# EAGLE design ax12board (EAGLE 5.06)
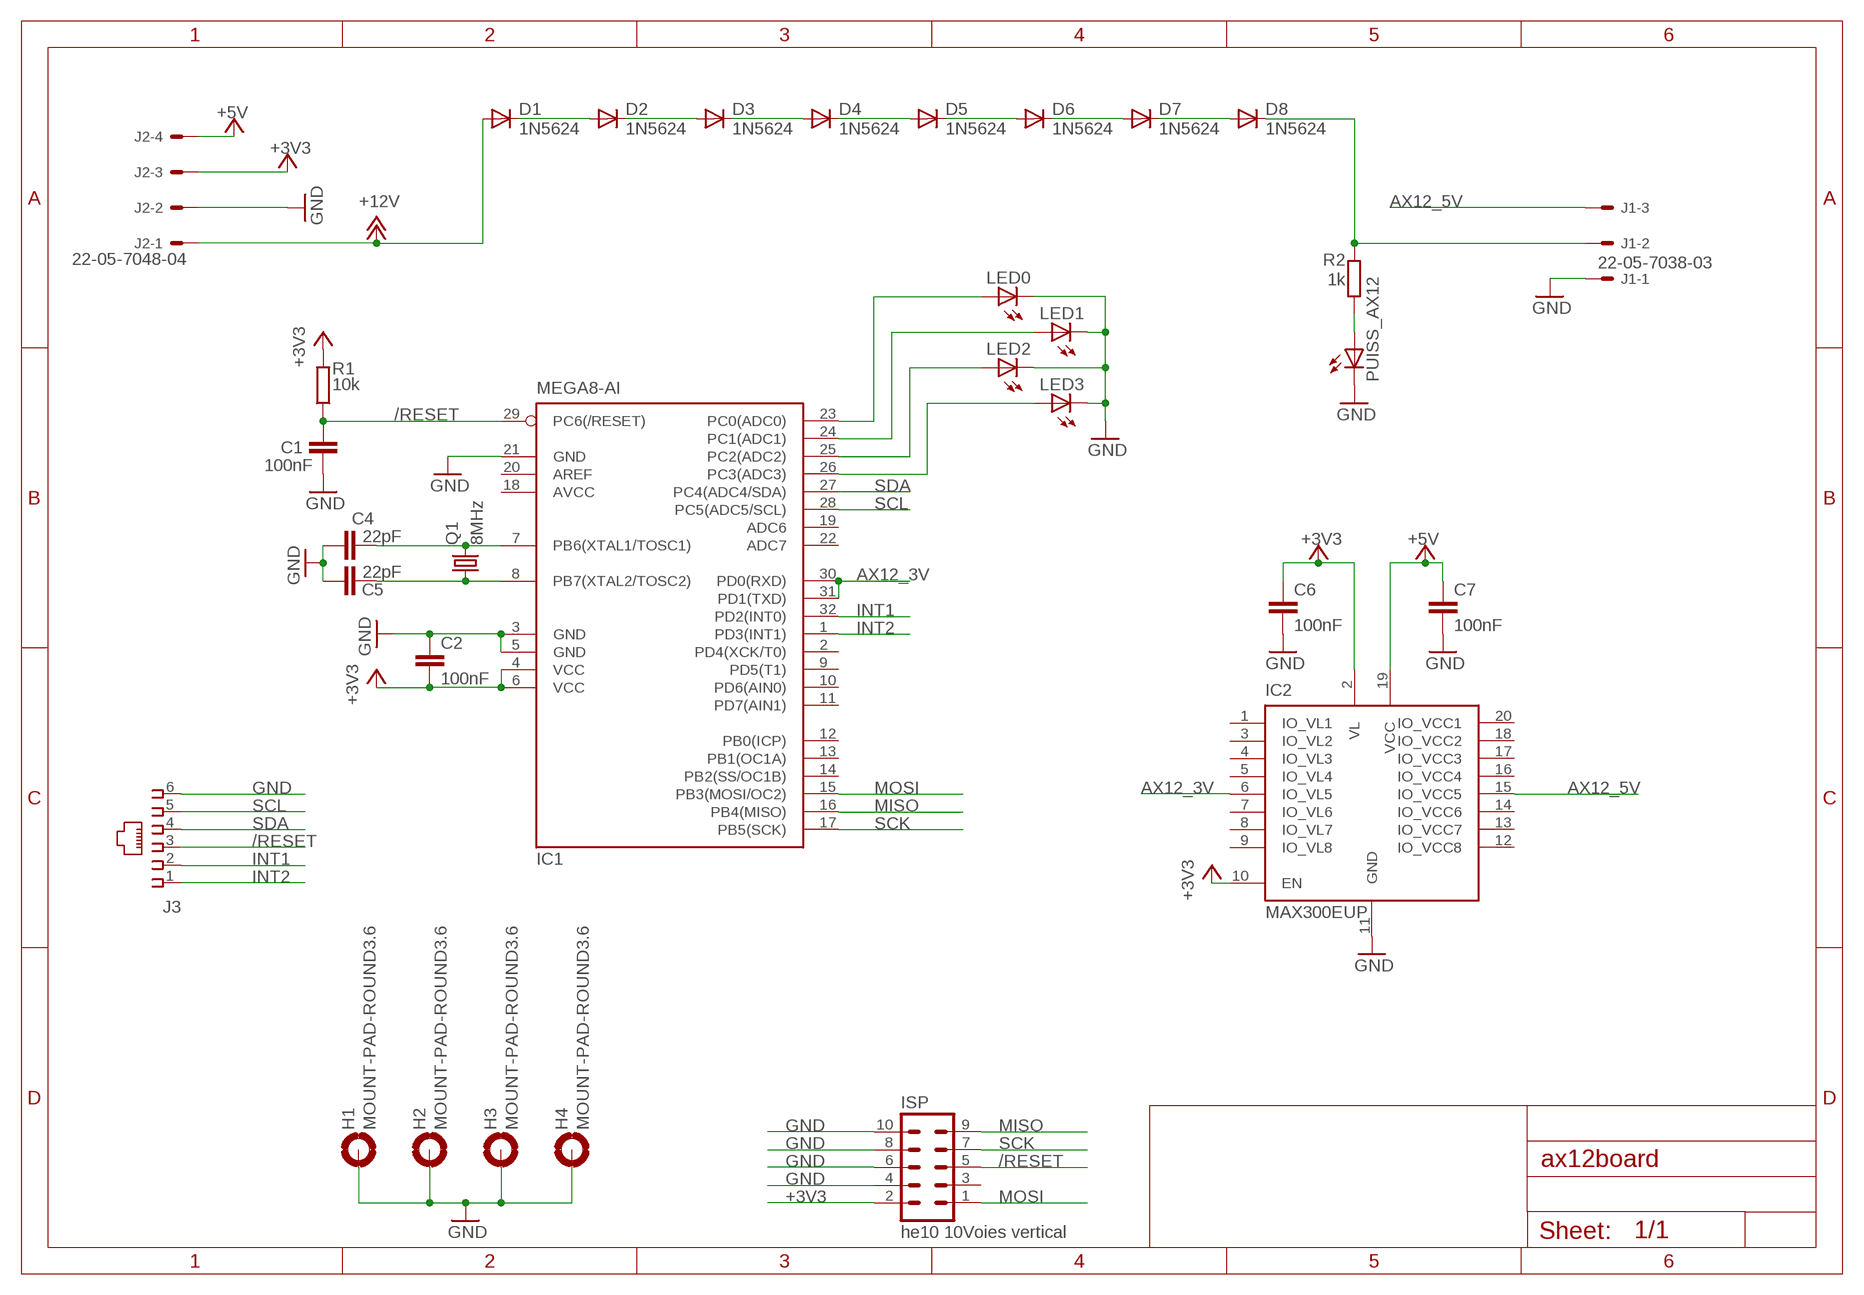
[diagram p0: schematic, sheet 1]

## Parts
C1  100nF  C-EU025-025X050  [C025-025X050]
C2  100nF  C-EU025-025X050  [C025-025X050]
C4  22pF  C-EUC0805  [C0805]
C5  22pF  C-EUC0805  [C0805]
C6  100nF  C-EU025-030X050  [C025-030X050]
C7  100nF  C-EU025-030X050  [C025-030X050]
D1  1N5624  [DO201-15]
D2  1N5624  [DO201-15]
D3  1N5624  [DO201-15]
D4  1N5624  [DO201-15]
D5  1N5624  [DO201-15]
D6  1N5624  [DO201-15]
D7  1N5624  [DO201-15]
D8  1N5624  [DO201-15]
H1  MOUNT-PAD-ROUND3.6  [3,6-PAD]
H2  MOUNT-PAD-ROUND3.6  [3,6-PAD]
H3  MOUNT-PAD-ROUND3.6  [3,6-PAD]
H4  MOUNT-PAD-ROUND3.6  [3,6-PAD]
IC1  MEGA8-AI  [TQFP32-08]
IC2  MAX300EUP  [TSSOP20]
ISP  he10 10Voies vertical  ML10L  [ML10L]
J1  22-05-7038-03  [7395-03]
J2  22-05-7048-04  [7395-04]
J3  520258-3  [520258-3]
LED0  LEDCHIPLED_1206  [CHIPLED_1206]
LED1  LEDCHIPLED_1206  [CHIPLED_1206]
LED2  LEDCHIPLED_1206  [CHIPLED_1206]
LED3  LEDCHIPLED_1206  [CHIPLED_1206]
PUISS_AX12  LEDCHIPLED_1206  [CHIPLED_1206]
Q1  8MHz  CRYSTALHC49S  [HC49/S]
R1  10k  R-EU_0207/10  [0207/10]
R2  1k  R-EU_R0805  [R0805]

## Nets
+3V3: C2.2 C6.1 IC1.4(VCC) IC1.6(VCC) IC2.2(VL) IC2.10(EN) ISP.2 J2.3 R1.2
+5V: C7.1 IC2.19(VCC) J2.4
+12V: D1.A J2.1
/RESET: C1.1 IC1.29(PC6(/RESET)) ISP.5 J3.3 R1.1
AX12_3V: IC1.30(PD0(RXD)) IC1.31(PD1(TXD)) IC2.6(IO_VL5)
AX12_5V: IC2.15(IO_VCC5) J1.3
GND: C1.2 C2.1 C4.1 C5.1 C6.2 C7.2 H1.B3,6(MOUNT) H2.B3,6(MOUNT) H3.B3,6(MOUNT) H4.B3,6(MOUNT) IC1.3(GND) IC1.5(GND) IC1.21(GND) IC2.11(GND) ISP.4 ISP.6 ISP.8 ISP.10 J1.1 J2.2 J3.6 LED0.C LED1.C LED2.C LED3.C PUISS_AX12.C
INT1: IC1.32(PD2(INT0)) J3.2
INT2: IC1.1(PD3(INT1)) J3.1
MISO: IC1.16(PB4(MISO)) ISP.9
MOSI: IC1.15(PB3(MOSI/OC2)) ISP.1
N$1: C4.2 IC1.7(PB6(XTAL1/TOSC1)) Q1.2
N$2: C5.2 IC1.8(PB7(XTAL2/TOSC2)) Q1.1
N$5: D1.C D2.A
N$6: D2.C D3.A
N$7: D3.C D4.A
N$9: D4.C D5.A
N$10: D5.C D6.A
N$11: D6.C D7.A
N$12: D7.C D8.A
N$13: D8.C J1.2 R2.2
N$14: PUISS_AX12.A R2.1
N$18: IC1.26(PC3(ADC3)) LED3.A
N$19: IC1.25(PC2(ADC2)) LED2.A
N$20: IC1.24(PC1(ADC1)) LED1.A
N$21: IC1.23(PC0(ADC0)) LED0.A
SCK: IC1.17(PB5(SCK)) ISP.7
SCL: IC1.28(PC5(ADC5/SCL)) J3.5
SDA: IC1.27(PC4(ADC4/SDA)) J3.4
Unconnected: IC1.2(PD4(XCK/T0)) IC1.9(PD5(T1)) IC1.10(PD6(AIN0)) IC1.11(PD7(AIN1)) IC1.12(PB0(ICP)) IC1.13(PB1(OC1A)) IC1.14(PB2(SS/OC1B)) IC1.19(ADC6) IC1.20(AREF) IC1.22(ADC7) IC2.1(IO_VL1) IC2.3(IO_VL2) IC2.4(IO_VL3) IC2.5(IO_VL4) IC2.7(IO_VL6) IC2.8(IO_VL7) IC2.9(IO_VL8) IC2.12(IO_VCC8) IC2.13(IO_VCC7) IC2.14(IO_VCC6) IC2.16(IO_VCC4) IC2.17(IO_VCC3) IC2.18(IO_VCC2) IC2.20(IO_VCC1) ISP.3

## Power pins joined to a net without a drawn wire
AVCC: IC1.18(AVCC)

## Library data of the parts
C1 C2 C4-C7 = rcl:C-EU: CAPACITOR, European symbol
D1-D8 = diode:1N5624: DIODE controlled avalanche rectifier
H1-H4 = holes:MOUNT-PAD-ROUND: MOUNTING PAD, round
IC1 = atmel:MEGA8: MICROCONTROLLER 8 Kbytes FLASH, 1 kbytes SRAM, 512 bytes EEPROM, USART, 6-channel 10 bit ADC, 2-channel 8 bit ADC Pin compatible with Atmega48, ATMega88, ATMega168 Source: avr.lbr
IC2 = robotter:MAX300*: max3000 to max3003 bidirectionnal level shifter
ISP = con-harting-ml:ML10: HARTING
J1 = con-molex:22-?-03: CONNECTOR wire to board 2.54 mm (.1 inch) pitch header
J2 = con-molex:22-?-04: CONNECTOR wire to board 2.54 mm (.1 inch) pitch header
J3 = con-amp:520258-3: AMP connector
LED0 LED1-LED3 PUISS_AX12 = led:LED: LED OSRAM: - CHIPLED LG R971, LG N971, LY N971, LG Q971, LY Q971, LO R971, LY R971 LH N974, LH R974 LS Q976, LO Q976, LY Q976 LO Q996 - Hyper CHIPLED LW Q18S LB Q993, LB Q99A, LB R99A - SideLED LS A670, LO A670, LY A670, LG A670, LP A670 LB A673, LV A673, LT A673, LW A673 LH A674 LY A675 LS A676, LA A676, LO A676, LY A676, LW A676 LS A679, LY A679, LG A679 - Hyper Micro SIDELED® LS Y876, LA Y876, LO Y876, LY Y876 LT Y87S - SmartLED LW L88C, LW L88S LB L89C, LB L89S, LG L890 LS L89K, LO L89K, LY L89K LS L896, LA L896, LO L896, LY L896 - TOPLED LS T670, LO T670, LY T670, LG T670, LP T670 LSG T670, LSP T670, LSY T670, LOP T670, LYG T670 LG T671, LOG T671, LSG T671 LB T673, LV T673, LT T673, LW T673 LH T674 LS T676, LA T676, LO T676, LY T676, LB T676, LH T676, LSB T676, LW T676 LB T67C, LV T67C, LT T67C, LS T67K, LO T67K, LY T67K, LW E67C LS E67B, LA E67B, LO E67B, LY E67B, LB E67C, LV E67C, LT E67C LW T67C LS T679, LY T679, LG T679 LS T770, LO T770, LY T770, LG T770, LP T770 LB T773, LV T773, LT T773, LW T773 LH T774 LS E675, LA E675, LY E675, LS T675 LS T776, LA T776, LO T776, LY T776, LB T776 LHGB T686 LT T68C, LB T68C - Hyper Mini TOPLED® LB M676 - Mini TOPLED Santana® LG M470 LS M47K, LO M47K, LY M47K Source: http://www.osram.convergy.de LUXEON: - LUMILED® LXK2-PW12-R00, LXK2-PW12-S00, LXK2-PW14-U00, LXK2-PW14-V00 LXK2-PM12-R00, LXK2-PM12-S00, LXK2-PM14-U00 LXK2-PE12-Q00, LXK2-PE12-R00, LXK2-PE12-S00, LXK2-PE14-T00, LXK2-PE14-U00 LXK2-PB12-K00, LXK2-PB12-L00, LXK2-PB12-M00, LXK2-PB14-N00, LXK2-PB14-P00, LXK2-PB14-Q00 LXK2-PR12-L00, LXK2-PR12-M00, LXK2-PR14-Q00, LXK2-PR14-R00 LXK2-PD12-Q00, LXK2-PD12-R00, LXK2-PD12-S00 LXK2-PH12-R00, LXK2-PH12-S00 LXK2-PL12-P00, LXK2-PL12-Q00, LXK2-PL12-R00 Source: www.luxeon.com KINGBRIGHT: KA-3528ASYC Source: www.kingbright.com
Q1 = crystal:CRYSTAL: CRYSTAL
R1 R2 = rcl:R-EU_: RESISTOR, European symbol

## Board
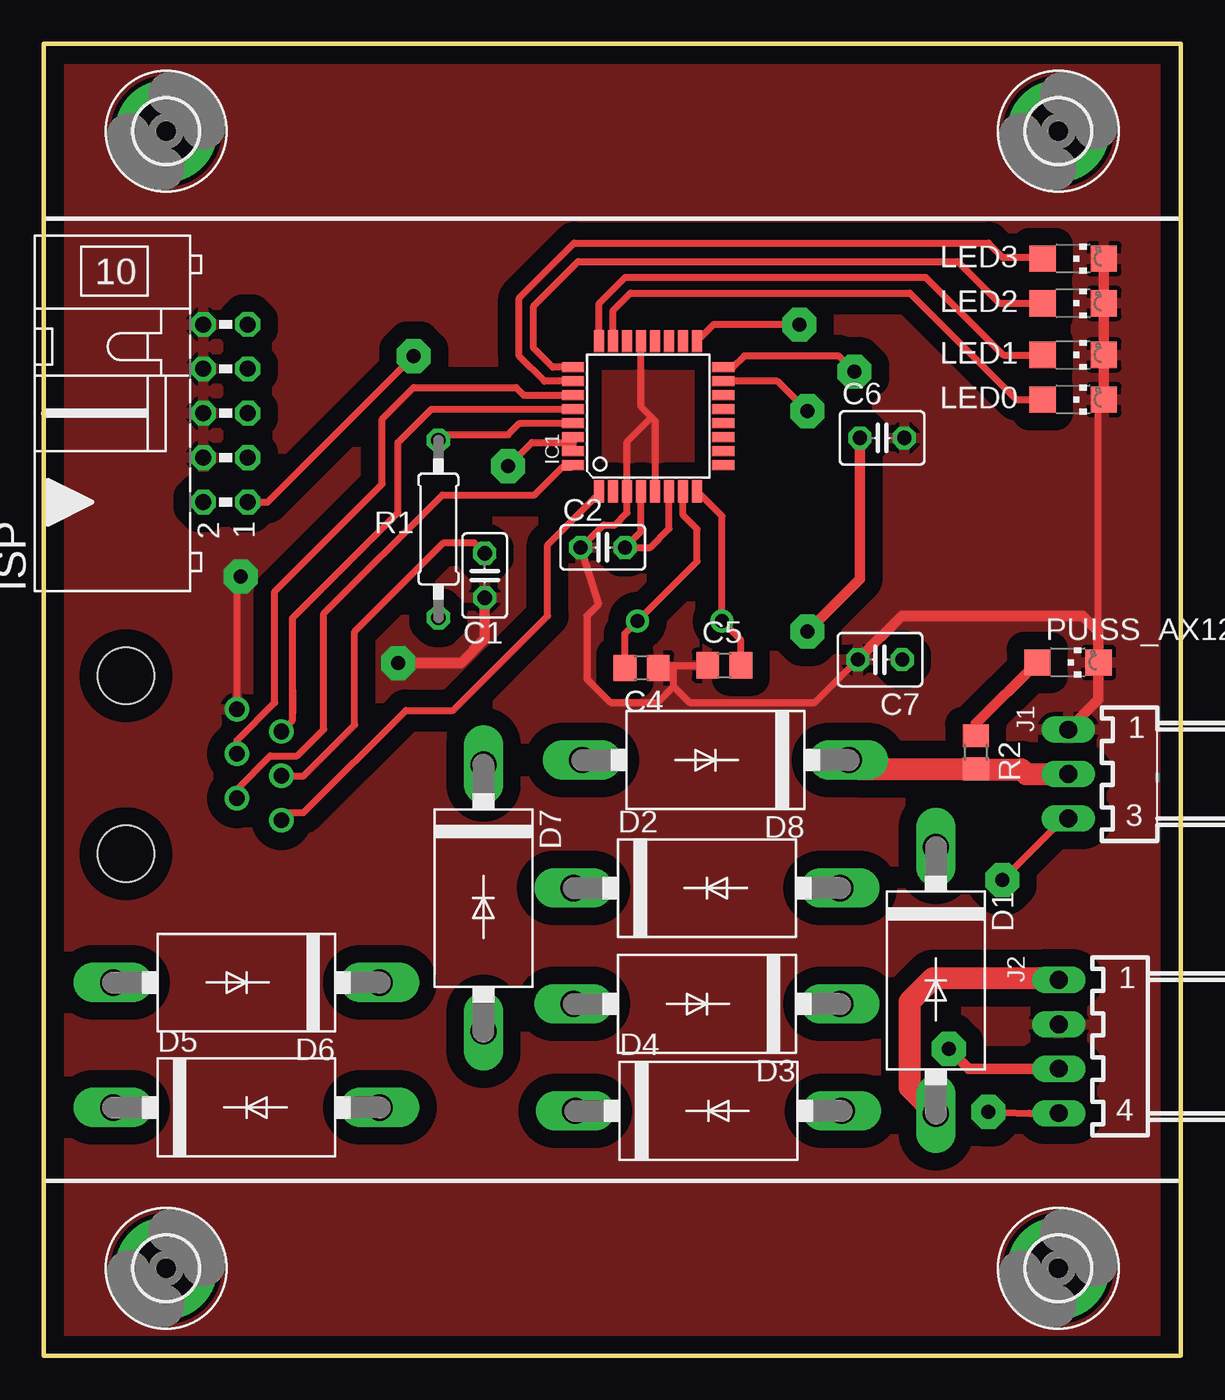
[diagram p1: board, top side]
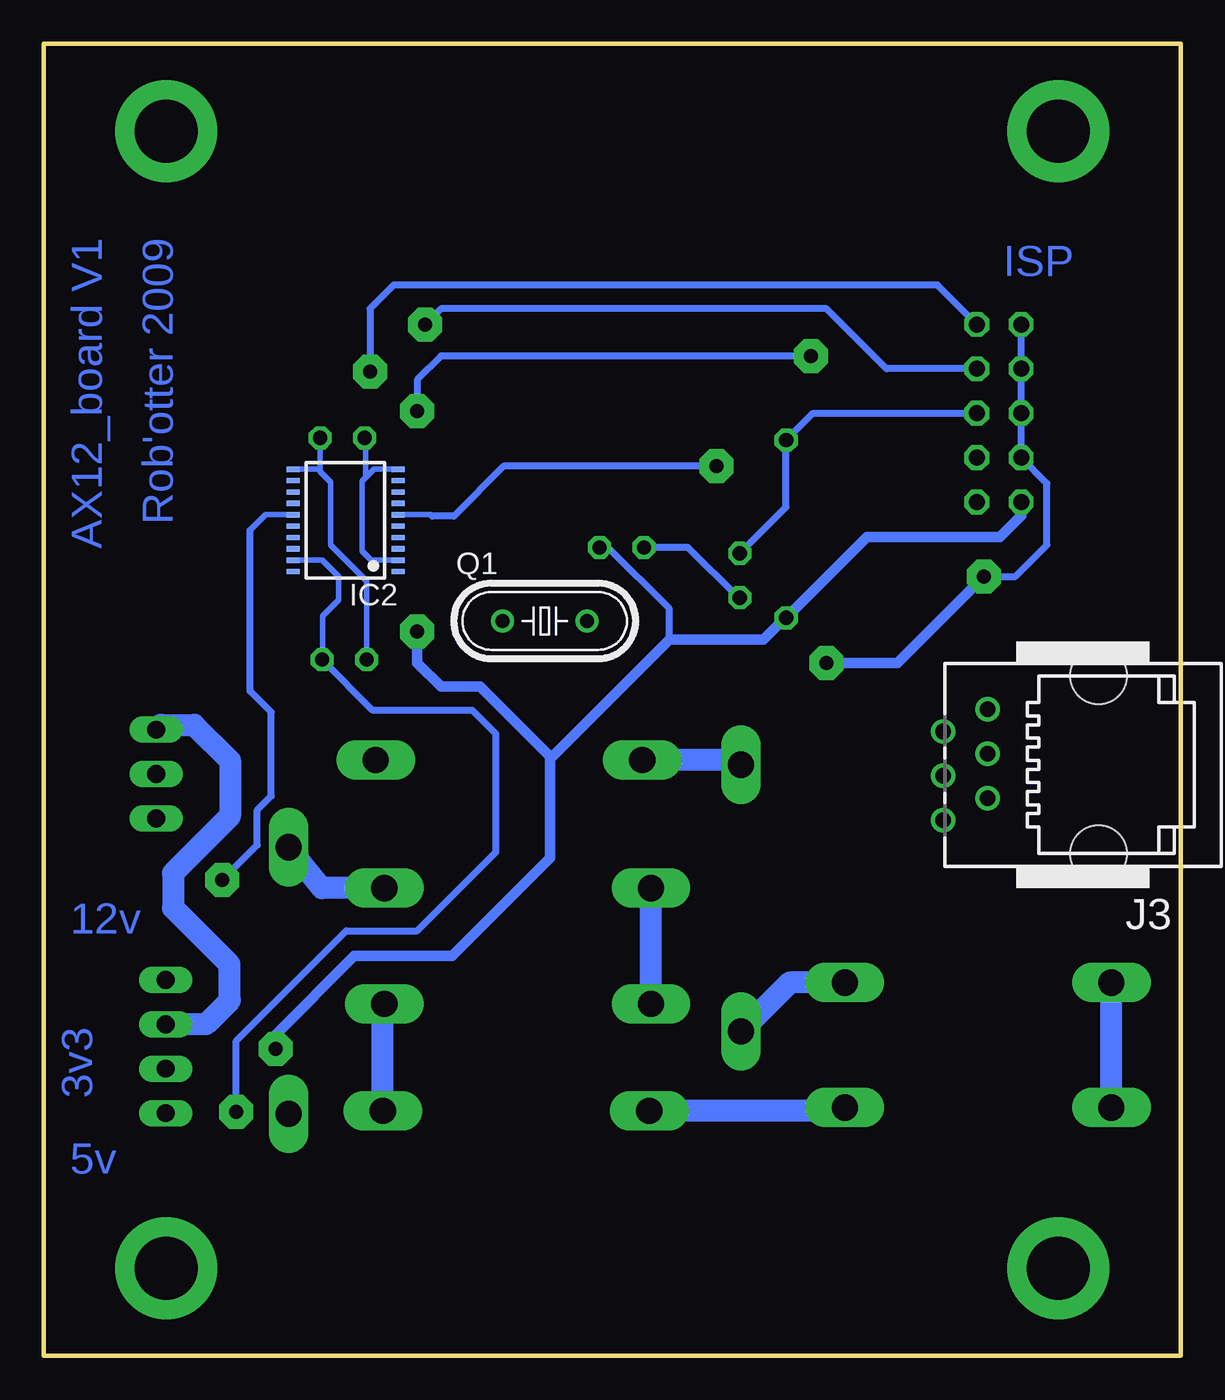
[diagram p2: board, bottom side, seen from below]

Size 65 x 75 mm. Coordinates in mm from the lower left corner, seen from the top.
Outline: 0,0 60,0
Outline: 0,55 0,10
Outline: 0,10 0,75 65,75 65,0 0,0
Outline: 0,10 0,0
Copper layers (1*16): Top 0.035mm / dielectric 1.5mm / Bottom 0.035mm
Design rules "default *": minimum track width 10mil, minimum drill 24mil, track to track 1mm, track to pad 1mm, pad to pad 8mil, via to via 8mil, smd to smd 8mil, copper to edge 40mil, drill to drill 8mil, minimum pad ring 10mil, minimum via ring 8mil, stop-mask expansion 4mil, vias tented up to drill 0mil, thermal gap 10mil

### Footprints (pad centres in the part's own frame; a part is rotated, then mirrored left to right if it is on the bottom)
C025-025X050 = drill 0.813 octagon: 1 -1.27,0; 2 1.27,0
C0805 = smd 1.3 x 1.5: 1 -0.95,0; 2 0.95,0
C025-030X050 = drill 0.813 octagon: 1 -1.27,0; 2 1.27,0
DO201-15 = drill 1.499 long: A 7.62,0; C -7.62,0
3,6-PAD = drill 3.6 pad 5.842 round: B3,6 0,0
TQFP32-08 = smd 1.27 x 0.559: 1 -4.293,2.8; 2 -4.293,2; 3 -4.293,1.2; 4 -4.293,0.4; 5 -4.293,-0.4; 6 -4.293,-1.2; 7 -4.293,-2; 8 -4.293,-2.8; 17 4.293,-2.8; 18 4.293,-2; 19 4.293,-1.2; 20 4.293,-0.4; 21 4.293,0.4; 22 4.293,1.2; 23 4.293,2; 24 4.293,2.8 | smd 0.559 x 1.27: 9 -2.8,-4.293; 10 -2,-4.293; 11 -1.2,-4.293; 12 -0.4,-4.293; 13 0.4,-4.293; 14 1.2,-4.293; 15 2,-4.293; 16 2.8,-4.293; 25 2.8,4.293; 26 2,4.293; 27 1.2,4.293; 28 0.4,4.293; 29 -0.4,4.293; 30 -1.2,4.293; 31 -2,4.293; 32 -2.8,4.293
TSSOP20 = smd 0.3 x 0.75: 1 -2.925,-3; 2 -2.275,-3; 3 -1.625,-3; 4 -0.975,-3; 5 -0.325,-3; 6 0.325,-3; 7 0.975,-3; 8 1.625,-3; 9 2.275,-3; 10 2.925,-3; 11 2.925,3; 12 2.275,3; 13 1.625,3; 14 0.975,3; 15 0.325,3; 16 -0.325,3; 17 -0.975,3; 18 -1.625,3; 19 -2.275,3; 20 -2.925,3
ML10L = drill 0.914 octagon: 1 -5.08,-1.27; 2 -5.08,1.27; 3 -2.54,-1.27; 4 -2.54,1.27; 5 0,-1.27; 6 0,1.27; 7 2.54,-1.27; 8 2.54,1.27; 9 5.08,-1.27; 10 5.08,1.27
7395-03 = drill 1.016 long: 1 2.54,0; 2 0,0; 3 -2.54,0
7395-04 = drill 1.016 long: 1 3.81,0; 2 1.27,0; 3 -1.27,0; 4 -3.81,0
520258-3 = drill 0.889 round: 1 -3.175,8.001; 2 -1.905,5.461; 3 -0.635,8.001; 4 0.635,5.461; 5 1.905,8.001; 6 3.175,5.461 | hole 3.251: -5.08,-0.889; 5.08,-0.889
CHIPLED_1206 = smd 1.5 x 1.5: A 0,-1.75; C 0,1.75
HC49/S = drill 0.813 round: 1 -2.413,0; 2 2.413,0
0207/10 = drill 0.813 octagon: 1 -5.08,0; 2 5.08,0
R0805 = smd 1.3 x 1.5: 1 -0.95,0; 2 0.95,0

### Placement (x,y rotation side)
C1  25.21,44.6 270 top
C2  31.96,46.21 0 top
C4  34.17,39.32 180 top
C5  38.9,39.47 0 top
C6  47.93,52.47 0 top
C7  47.81,39.79 180 top
D1  51,21.45 270 top
D2  37.91,26.73 0 top
D3  37.91,20.11 180 top
D4  38,14 0 top
D5  11.59,14.19 0 top
D6  11.59,21.33 180 top
D7  25.14,26.16 270 top
D8  38.4,34.05 180 top
H1  7,5 0 top
H2  58,5 0 top
H3  7,70 0 top
H4  58,70 0 top
IC1  34.55,53.71 90 top
IC2  47.75,47.75 90 bottom
ISP  10.4,53.88 90 top
J1  58.57,33.25 90 top
J2  58.03,17.68 90 top
J3  5.59,33.78 90 bottom
LED0  58.84,54.66 270 top
LED1  58.84,57.21 270 top
LED2  58.84,60.16 270 top
LED3  58.84,62.72 270 top
PUISS_AX12  58.55,39.63 270 top
Q1  36.36,42 0 bottom
R1  22.56,47.26 270 top
R2  53.29,34.5 270 top

### Tracks (layer width: path | path; a pad name or v marks a point on that pad's centre or on a via)
+3V3  (via drill 0.8 pad 1.93)
  Top 0.406: IC1.6 35.75,47.28 34.68,46.21 C2.2 34.15,47.13 IC1.4
  Top 0.61: v51.75,17.55 52.89,16.41 J2.3 | v43.65,41.4 46.66,44.41 C6.1
  Bottom 0.305: IC2.10 46.12,50.68 46.6,50.2 | 46.6,50.2 46.8,50 46.8,46 46.28,45.48 IC2.2 | C6.1 46.6,52.41 46.6,50.2
  Bottom 0.406: 9.13,48.02 ISP.2 | R1.2 22.62,42.18 | C2.2 32.74,46.21 29.24,42.7 29.24,40.95
  Bottom 0.61: 9.13,48.02 10.35,46.8 17.94,46.8 R1.2 | 22.62,42.18 23.85,40.95 29.24,40.95 36.07,34.12 | v51.75,17.55 51.75,18.35 47.24,22.86 41.66,22.86 36.07,28.45 36.07,34.12 | 36.07,34.12 36.07,34.27 40.05,38.25 42.3,38.25 43.65,39.6 v43.65,41.4
+5V  (via drill 0.8 pad 1.93)
  Top 0.406: v54,13.95 56.33,13.87 J2.4
  Bottom 0.305: IC2.19 49.08,45.48 48.15,44.55 48.15,43.2 49.05,42.3 49.05,39.82 C7.1
  Bottom 0.406: C7.1 46.19,36.9 40.5,36.9 39.15,35.55 39.15,28.8 43.65,24.3 47.7,24.3 54,18 v54,13.95
+12V
  Top 1.27: J2.1 57.92,21.6 50.85,21.6 49.5,20.25 49.5,15.33 D1.A
/RESET
  Top 0.406: J3.3 14.86,33.15 17.78,36.07 17.78,41.4 22.86,46.48 24.6,46.48 C1.1 | IC1.29 27.21,53.31 26.55,52.65 22.87,52.65 R1.1
  Bottom 0.406: C1.1 22.56,48.52 R1.1 21.02,53.88 ISP.5
AX12_3V  (via drill 0.8 pad 1.93)
  Top 0.406: 30.22,51.75 IC1.31 IC1.30 30.26,52.31 30.15,52.2 27.9,52.2 v26.55,50.85
  Bottom 0.305: IC2.6 42.88,48.08 42.8,48
  Bottom 0.406: 42.8,48 41.55,48 38.7,50.85 v26.55,50.85
AX12_5V  (via drill 0.8 pad 1.93)
  Top 0.406: J1.3 58.31,30.71 v54.8,27.2
  Bottom 0.305: IC2.15 52.32,48.08 53.2,47.2
  Bottom 0.406: 53.2,47.2 53.2,38 52,36.8 52,32 52.8,31.2 52.8,29.2 v54.8,27.2
GND  (via drill 0.8 pad 1.93)
  Top 0.406: IC1.21 34.15,54.25 34.75,53.65 | IC1.5 34.95,53.45 34.75,53.65 | 36,39.47 35.28,39.47 C4.1 | 36,39.47 C5.1 | 34.75,53.65 33.35,52.25 IC1.3 33.35,48.2 32.65,47.5 32,47.5 30.71,46.21 C2.1 31.7,42.95 31.05,42.3 31.05,38.7 32.4,37.35 35.1,37.35 36,38.25 | 36,38.25 36,39.47 | PUISS_AX12.C 60.3,54.36 LED0.C | J3.6 11.05,44.35 v11.25,44.55 | C7.2 44.1,37.35 36.9,37.35 36,38.25
  Top 0.61: J1.1 60.3,37.52 PUISS_AX12.C 60.3,41.4 59.4,42.3 49.05,42.3 C7.2 | C1.2 25.21,40.96 23.85,39.6 v20.25,39.6 | LED0.C LED1.C LED2.C LED3.C
  Bottom 0.305: C7.2 46.54,44.29 48.6,46.35 48.6,49.95 48.83,50.17 | IC2.11 49.33,50.68 48.83,50.17 | C6.2 49.2,50.55 48.83,50.17
  Bottom 0.406: ISP.10 ISP.8 ISP.6 ISP.4 7.65,49.86 7.65,46.35 9.45,44.55 v11.25,44.55 | C1.2 25.3,43.33 28.17,46.21 C2.1
  Bottom 0.61: v20.25,39.6 16.2,39.6 v11.25,44.55
  Bottom 1.27: J2.2 55.73,18.95 54.36,20.32 54.4,20.36 54.4,22.4 57.6,25.6 57.6,27.6 54.36,30.84 54.36,34.04 56.39,36.07 58.29,36.07 J1.1
  pour Top: -1.25,-1.95 -2.25,74.25 0.9,77.4 63.45,77.4 69.2,72.65 70.2,7.65 65.35,-3.2 1,-3.2
INT1
  Top 0.406: J3.2 11.05,32.38 12.95,34.29 14.48,34.29 16,35.81 16,42.42 22.79,49.21 28.06,49.21 29.65,50.8 30.15,50.8 IC1.32
INT2
  Top 0.406: IC1.1 31.75,49.3 28.8,46.35 28.8,42.3 23.4,36.9 20.7,36.9 14.85,31.05 14.03,31.05 J3.1
MISO  (via drill 0.8 pad 1.93)
  Top 0.406: IC1.16 39.41,56.51 40.05,57.15 45.45,57.15 v46.35,56.25
  Bottom 0.406: v46.35,56.25 46.35,59.85 45,61.2 13.91,61.2 ISP.9
MOSI  (via drill 0.8 pad 1.93)
  Top 0.406: ISP.1 12.8,48.8 v21.15,57.15 | IC1.15 41.94,55.71 v43.65,54
  Bottom 0.406: v21.15,57.15 42.3,57.15 43.65,55.8 v43.65,54
N$1
  Top 0.406: IC1.7 36.55,48.05 37.35,47.25 37.35,45.41 Q1.2 33.22,41.28 C4.2
N$2
  Top 0.406: IC1.8 38.77,47.99 Q1.1 39.85,40.93 C5.2
N$5
  Bottom 1.27: D1.C 49.11,26.73 D2.A
N$6
  Bottom 1.27: D3.A D2.C
N$7
  Bottom 1.27: D3.C 45.62,20.02 D4.A
N$9
  Bottom 1.27: D5.A 19.4,14 D4.C
N$10
  Bottom 1.27: D5.C D6.A
N$11
  Bottom 1.27: D7.A 22.35,21.34 18.8,21.34 18.8,21.33 D6.C
N$12
  Bottom 1.27: D7.C 25.41,34.05 D8.A
N$13
  Top 1.27: D8.C 46.52,33.55 R2.2 53.31,33.53 55.88,33.53 56.16,33.25 J1.2
N$14
  Top 0.61: PUISS_AX12.A 53.29,36.13 R2.1
N$18
  Top 0.406: IC1.26 28.62,55.71 27.18,57.15 27.18,60.45 30.33,63.6 54,63.6 54.8,62.8 57.01,62.8 LED3.A
N$19
  Top 0.406: IC1.25 29.09,56.51 28,57.6 28,60 30.55,62.55 52.25,62.55 54.64,60.16 LED2.A
N$20
  Top 0.406: IC1.24 31.75,60.15 33.25,61.65 50.4,61.65 54.85,57.2 LED1.A
N$21
  Top 0.406: IC1.23 32.55,59.75 33.55,60.75 49.5,60.75 55.59,54.66 LED0.A
SCK  (via drill 0.8 pad 1.93)
  Top 0.406: v43.2,58.95 38.3,58.95 IC1.17
  Bottom 0.406: ISP.7 16.82,56.42 20.25,59.85 42.3,59.85 v43.2,58.95
SCL
  Top 0.406: 14.22,38.1 14.22,36.72 | 14.22,38.1 14.22,42.16 20.25,48.19 20.25,52.2 22.16,54.11 IC1.28 | J3.5 14.22,36.32 14.22,38.1
SDA
  Top 0.406: J3.4 11.05,35.18 13.21,37.34 13.21,43.69 19.35,49.83 19.35,53.55 21.15,55.35 27,55.35 27.44,54.91 IC1.27

### Text on the board
Top: top
Bottom: ISP | Rob'otter 2009 | AX12_board V1 | 12v | 3v3 | bot | 5v
Dimension: un texte pour les aligner tous